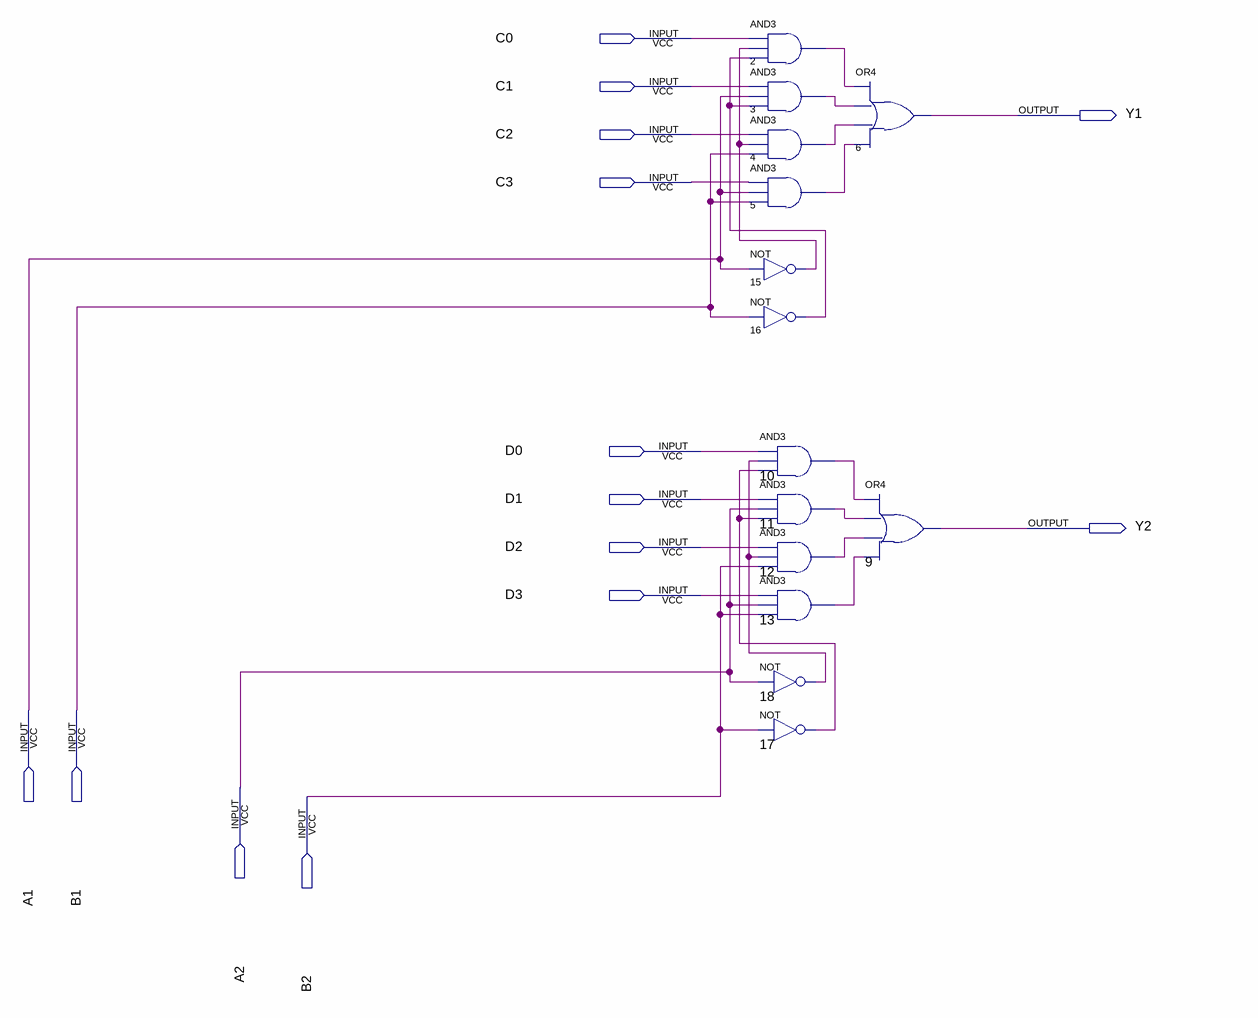
[diagram p0: schematic sheet]
// Quartus schematic deco.bdf as structural Verilog: 14 symbols, 14 pins
module deco (
  input  C0,
  input  C1,
  input  C2,
  input  C3,
  input  D0,
  input  D1,
  input  D2,
  input  D3,
  input  A1,
  input  B1,
  input  A2,
  input  B2,
  output Y1,
  output Y2
);

  wire n2_out, n3_out, n4_out, n5_out, n10_out, n11_out, n12_out, n13_out, n15_out, n16_out, n17_out, n18_out;

  and u_2 (n2_out, C0, n15_out, n16_out);
  and u_3 (n3_out, C1, A1, n16_out);
  and u_4 (n4_out, C2, n15_out, B1);
  and u_5 (n5_out, C3, A1, B1);
  not u_15 (n15_out, A1);
  not u_16 (n16_out, B1);
  and u_10 (n10_out, D0, n18_out, n17_out);
  and u_11 (n11_out, D1, A2, n17_out);
  and u_12 (n12_out, D2, n18_out, B2);
  and u_13 (n13_out, D3, A2, B2);
  not u_18 (n18_out, A2);
  not u_17 (n17_out, B2);
  or u_6 (Y1, n2_out, n3_out, n4_out, n5_out);
  or u_9 (Y2, n10_out, n11_out, n12_out, n13_out);
endmodule
